# EAGLE design 3_phase_rectifier_reverse_protection (EAGLE 9.6.2)
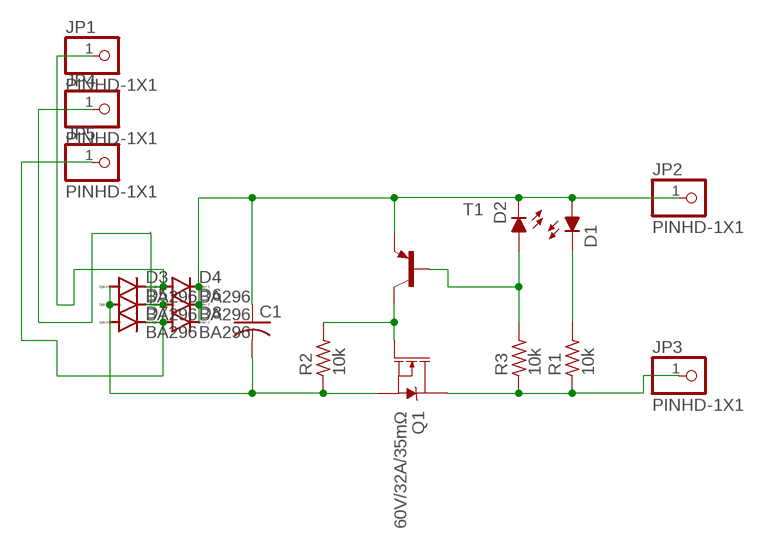
[diagram p0: schematic, sheet 1]

## Parts
C1  C-US025-024X044  [C025-024X044]
D1  LED_LEDCHIP-LED0603MP  [LED_CHIP-LED0603MP]
D2  LED_LEDCHIP-LED0603MP  [LED_CHIP-LED0603MP]
D3  BA296  [P2-15]
D4  BA296  [P2-15]
D5  BA296  [P2-15]
D6  BA296  [P2-15]
D7  BA296  [P2-15]
D8  BA296  [P2-15]
JP1  PINHD-1X1  [1X01]
JP2  PINHD-1X1  [1X01]
JP3  PINHD-1X1  [1X01]
JP4  PINHD-1X1  [1X01]
JP5  PINHD-1X1  [1X01]
Q1  60V/32A/35mΩ  MOSFET-NCH-FQP30N06L  [TO220V]
R1  10k  RC-MASTER-SMD_R_0603MP  [RC-MASTER-SMD_R0603MP]
R2  10k  RC-MASTER-SMD_R_0603MP  [RC-MASTER-SMD_R0603MP]
R3  10k  RC-MASTER-SMD_R_0603MP  [RC-MASTER-SMD_R0603MP]
T1  -PNP-SC59-BEC  [SC59-BEC]

## Nets
GND: JP3.1 Q1.2(D) R1.1 R3.1
N$1: D3.C D4.A JP1.1
N$3: Q1.1(G) R2.2 T1.C
N$4: D2.A R3.2 T1.B
N$5: D1.C R1.2
N$9: D5.C D6.A JP4.1
N$10: D7.C D8.A JP5.1
N$13: C1.2 D3.A D5.A D7.A Q1.3(S) R2.1
VCC: C1.1 D1.A D2.C D4.C D6.C D8.C JP2.1 T1.E

## Library data of the parts
C1 = BeagleBone_Black_Wireless:C-US: CAPACITOR, American symbol
D1 D2 = 52101-101-REV-A_v16:LED_LED: LED Various Types
D3-D8 = diode:BA296: DIODE
JP1-JP5 = Connector:PINHD-1X1: PIN HEADER; CATEGORY: CONNECTOR; SUB-CATEGORY: PIN-HEADER
Q1 = SparkFun-DiscreteSemi:MOSFET-NCH: N-channel MOSFETs Voltage controlled devices that allow control of high current outputs. SparkFun Products: SparkFun OpenScale <https://www.sparkfun.com/products/13261> SparkFun Digital Sandbox <https://www.sparkfun.com/products/12651> SparkFun Monster Moto Shield <https://www.sparkfun.com/products/10182> SparkFun MOSFET Power Controller <https://www.sparkfun.com/products/11214>; PROD_ID: TRANS-10060
R1-R3 = 52101-101-REV-A_v16:RC-MASTER-SMD_R_: RESISTOR
T1 = DC_LOAD_AU:*-PNP-: PNP Transistror

## Board
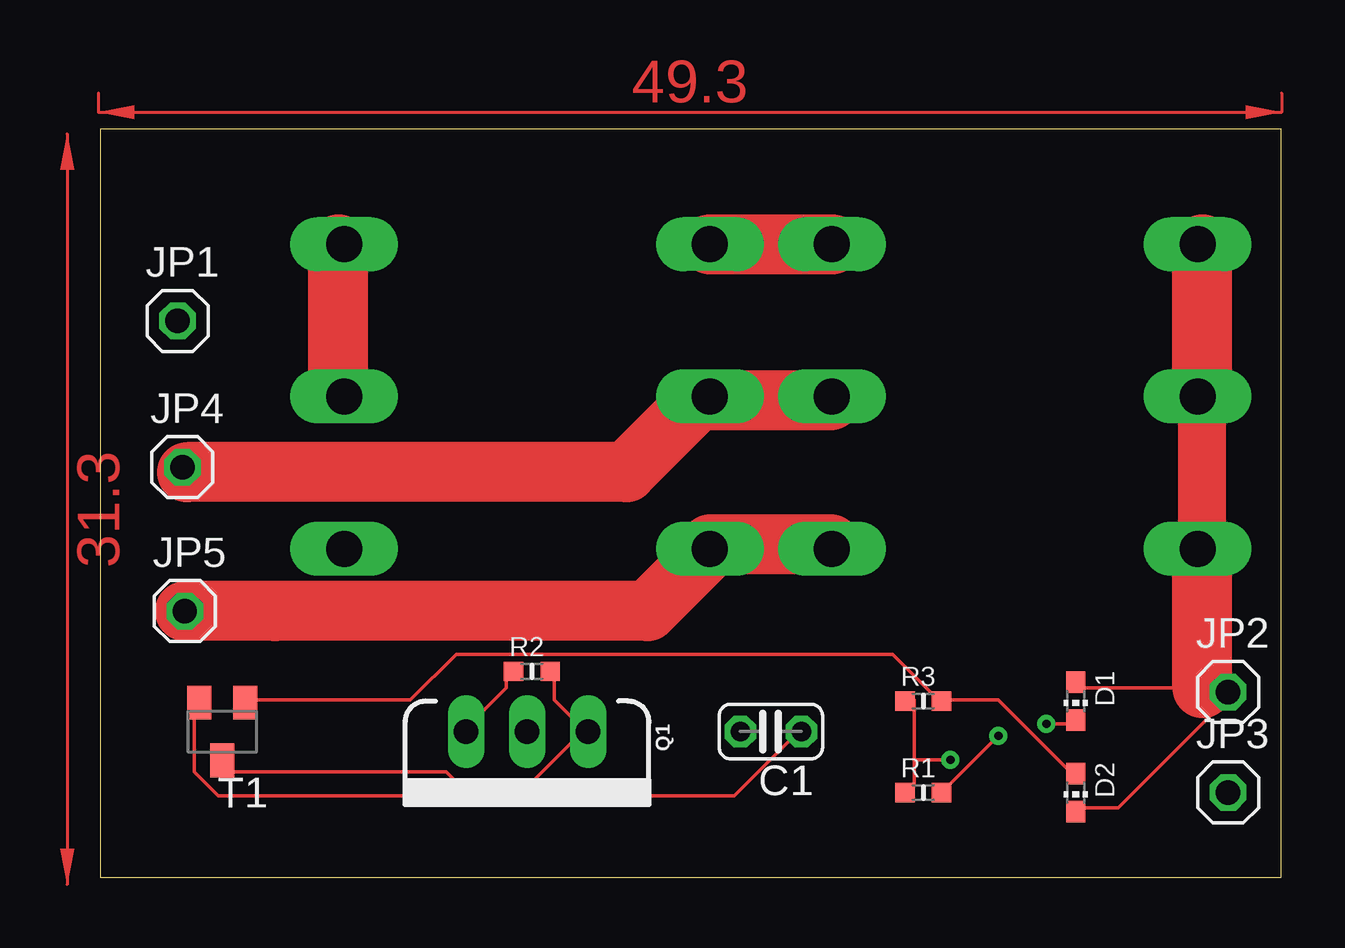
[diagram p1: board, top side]
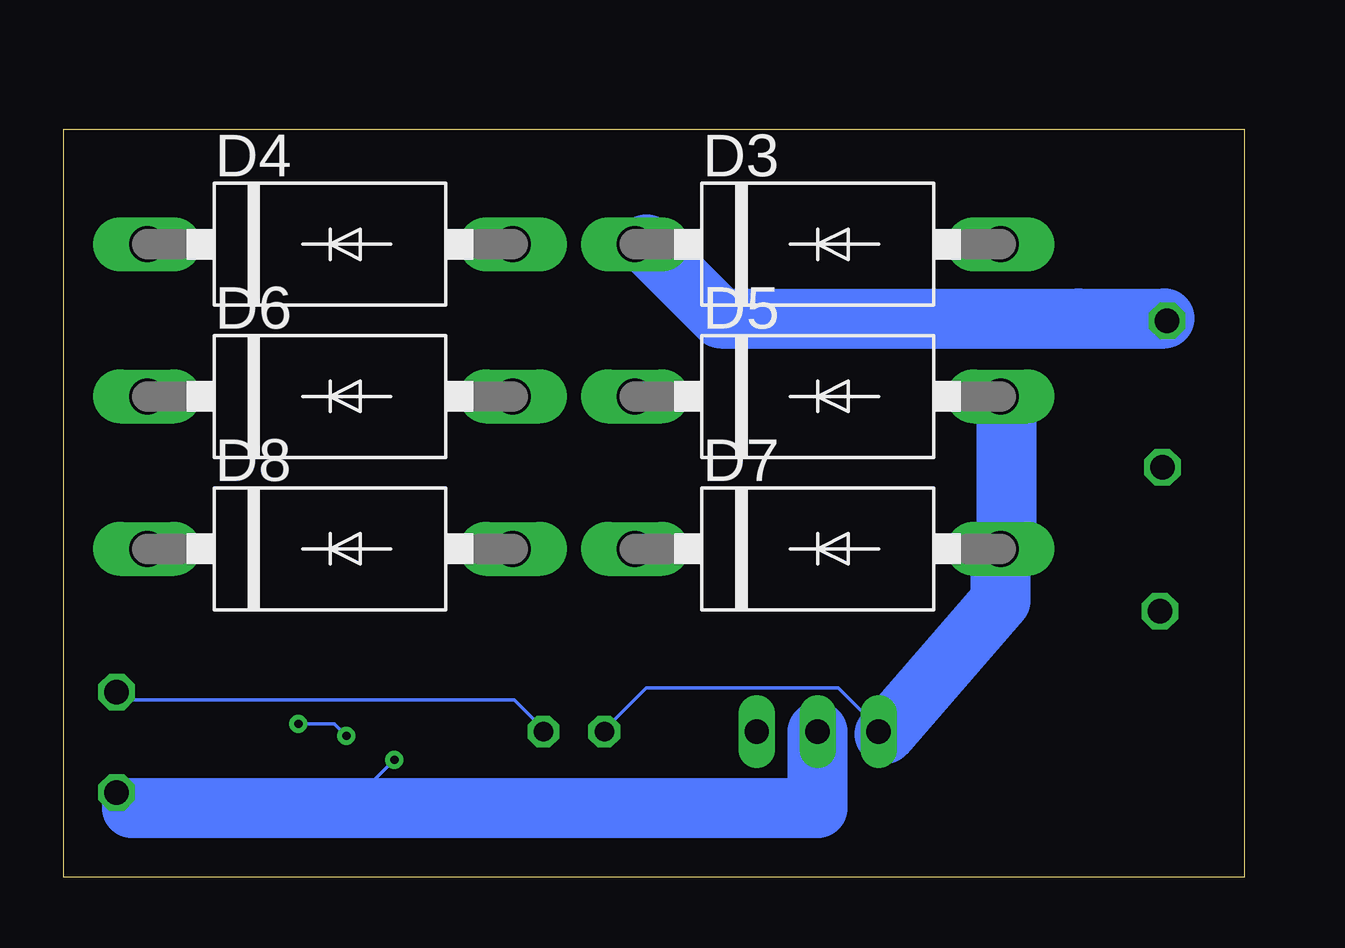
[diagram p2: board, bottom side, seen from below]

Size 49.2 x 31.2 mm. Coordinates in mm from the lower left corner, seen from the top.
Outline: 0,0 49.2,0 49.2,31.2 0,31.2 0,0
Copper layers (1*16): Top 0.035mm / dielectric 1.5mm / Bottom 0.035mm
Design rules "default": minimum track width 6mil, minimum drill 0.35mm, track to track 6mil, track to pad 6mil, pad to pad 6mil, via to via 6mil, smd to smd 6mil, copper to edge 40mil, drill to drill 6mil, minimum pad ring 10mil, minimum via ring 8mil, stop-mask expansion 4mil, vias tented up to drill 0mil, thermal gap 10mil

### Footprints (pad centres in the part's own frame; a part is rotated, then mirrored left to right if it is on the bottom)
C025-024X044 = drill 0.813 octagon: 1 -1.27,0; 2 1.27,0
LED_CHIP-LED0603MP = smd 0.8 x 0.9: A 0,-0.794; C 0,0.794
P2-15 = drill 1.499 long: A 7.62,0; C -7.62,0
1X01 = drill 1.016 octagon: 1 0,0
TO220V = drill 1.016 long: 1 -2.54,0; 2 0,0; 3 2.54,0
RC-MASTER-SMD_R0603MP = smd 0.8 x 0.8: 1 -0.762,0; 2 0.762,0
SC59-BEC = smd 1 x 1.4: B -0.95,-1.2; C 0,1.2; E 0.95,-1.2

### Placement (x,y rotation side)
C1  27.94,6.08 180 top
D1  40.64,7.35 180 top
D2  40.64,3.54 180 top
D3  17.78,26.4 0 bottom
D4  38.1,26.4 0 bottom
D5  17.78,20.05 0 bottom
D6  38.1,20.05 0 bottom
D7  17.78,13.7 0 bottom
D8  38.1,13.7 0 bottom
JP1  3.22,23.2 0 top
JP2  46.99,7.73 0 top
JP3  46.99,3.54 0 top
JP4  3.42,17.1 0 top
JP5  3.52,11.1 0 top
Q1  17.78,6.08 180 top
R1  34.29,3.54 0 top
R2  17.98,8.59 0 top
R3  34.29,7.35 0 top
T1  5.08,6.08 180 top

### Tracks (layer width: path | path; a pad name or v marks a point on that pad's centre or on a via)
GND  (via drill 0.35)
  Top 0.152: 33.92,4.9 33.92,7.4 R3.1 | 33.92,4.9 33.92,3.9 R1.1 | v35.42,4.9 33.92,4.9
  Bottom 0.152: 37.42,2.9 v35.42,4.9 | JP3.1 46.35,2.9
  Bottom 2.5: 46.35,2.9 37.42,2.9 17.78,2.9 Q1.2
N$1
  Top 2.5: D3.C D4.A
  Bottom 0.152: 24.92,26.4 D3.C
  Bottom 0.508: 3.32,23.3 JP1.1
  Bottom 2.5: 24.92,26.4 21.82,23.3 6.91,23.3 3.32,23.3
N$3
  Top 0.152: R2.2 18.92,8.59 18.92,7.4 19.92,6.4 Q1.1 19.92,5.9 17.92,3.9 14.92,3.9 14.42,4.4 5.42,4.4 T1.C
N$4
  Top 0.152: D2.A 40.42,4.4 37.42,7.4 35.42,7.4 R3.2 34.92,7.4 33.02,9.3 14.82,9.3 12.92,7.4 6.42,7.4 T1.B
N$5  (via drill 0.35)
  Top 0.152: v37.42,5.9 35.42,3.9 R1.2 | v39.42,6.4 40.42,6.4 D1.C
  Bottom 0.152: v37.42,5.9 37.92,6.4 v39.42,6.4
N$9
  Top 0.152: 24.92,19.9 D5.C 25.42,19.9 | 30.42,19.9 D6.A
  Top 0.508: 3.62,16.9 JP4.1
  Top 2.5: 24.92,19.9 21.92,16.9 3.62,16.9 | 25.42,19.9 30.42,19.9
N$10
  Top 0.152: 30.42,13.9 D8.A | 25.42,13.9 D7.C
  Top 2.5: D7.C 22.8,11.1 7.27,11.1 JP5.1 | 25.42,13.9 30.42,13.9
N$13
  Top 0.152: R2.1 16.92,8.62 16.92,7.9 15.42,6.4 Q1.3 | 9.92,26.4 D3.A | 9.92,20.4 D5.A
  Top 2.5: 9.92,20.4 9.92,26.4
  Bottom 0.152: 14.99,5.97 15.42,6.4 | 15.42,6.4 16.92,7.9 24.92,7.9 26.42,6.4 C1.2 | 15.42,6.4 Q1.3 | 9.92,13.9 D7.A | 9.92,19.9 D5.A
  Bottom 2.5: 9.92,19.9 9.92,13.9 | 14.99,5.97 10.16,11.55 D7.A
VCC
  Top 0.152: T1.E 3.92,6.9 3.92,4.4 4.92,3.4 26.42,3.4 28.92,5.9 C1.1 | D2.C 40.92,2.9 42.42,2.9 46.92,7.4 JP2.1 46.92,7.9 45.92,7.9 40.92,7.9 D1.A | 45.92,13.4 D8.C 45.92,13.9 | 45.92,19.9 D6.C 45.92,20.4 | 45.92,26.4 D4.C
  Top 2: 45.92,13.9 45.92,19.9
  Top 2.5: 45.92,7.9 45.92,13.4 | 45.92,20.4 45.92,26.4
  Bottom 0.152: C1.1 29.42,6.4 30.42,7.4 46.92,7.4 JP2.1
(copper drawn outside any net)
  shapes: Top area x2